# EAGLE design untitled (EAGLE 6.1)
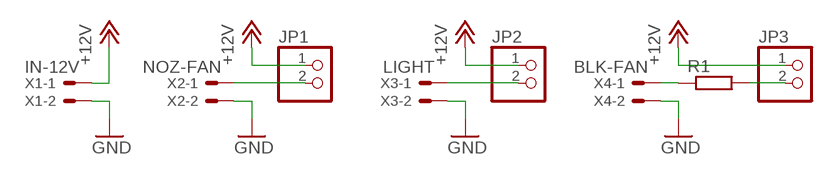
[diagram p0: schematic, sheet 1]

## Parts
JP1  PINHD-1X2  [1X02]
JP2  PINHD-1X2  [1X02]
JP3  PINHD-1X2  [1X02]
R1  R-EU_0204/7  [0204/7]
X1  IN-12V  JST-XH-02-PIN-LONG-PAD  [JST-XH-02-PACKAGE-LONG-PAD]
X2  NOZ-FAN  JST-XH-02-PIN-LONG-PAD  [JST-XH-02-PACKAGE-LONG-PAD]
X3  LIGHT  JST-XH-02-PIN-LONG-PAD  [JST-XH-02-PACKAGE-LONG-PAD]
X4  BLK-FAN  JST-XH-02-PIN-LONG-PAD  [JST-XH-02-PACKAGE-LONG-PAD]

## Nets
+12V: JP1.1 JP2.1 JP3.1 X1.1
GND: X1.2 X2.2 X3.2 X4.2
N$1: JP1.2 X2.1
N$2: JP2.2 X3.1
N$3: R1.1 X4.1
N$4: JP3.2 R1.2

## Library data of the parts
JP1-JP3 = pinhead:PINHD-1X2: PIN HEADER
R1 = rcl:R-EU_: RESISTOR, European symbol
X1-X4 = Rembrandt Electronics - JST XH Connectors v1-0:JST-XH-02-PIN: JST XH Connector 2 Pin Wire to board connector. Pitch: 2,54 mm, (0.100") Number of pins: 2 Created by Rembrandt Electronics www.rembrandtelectronics.com

## Board
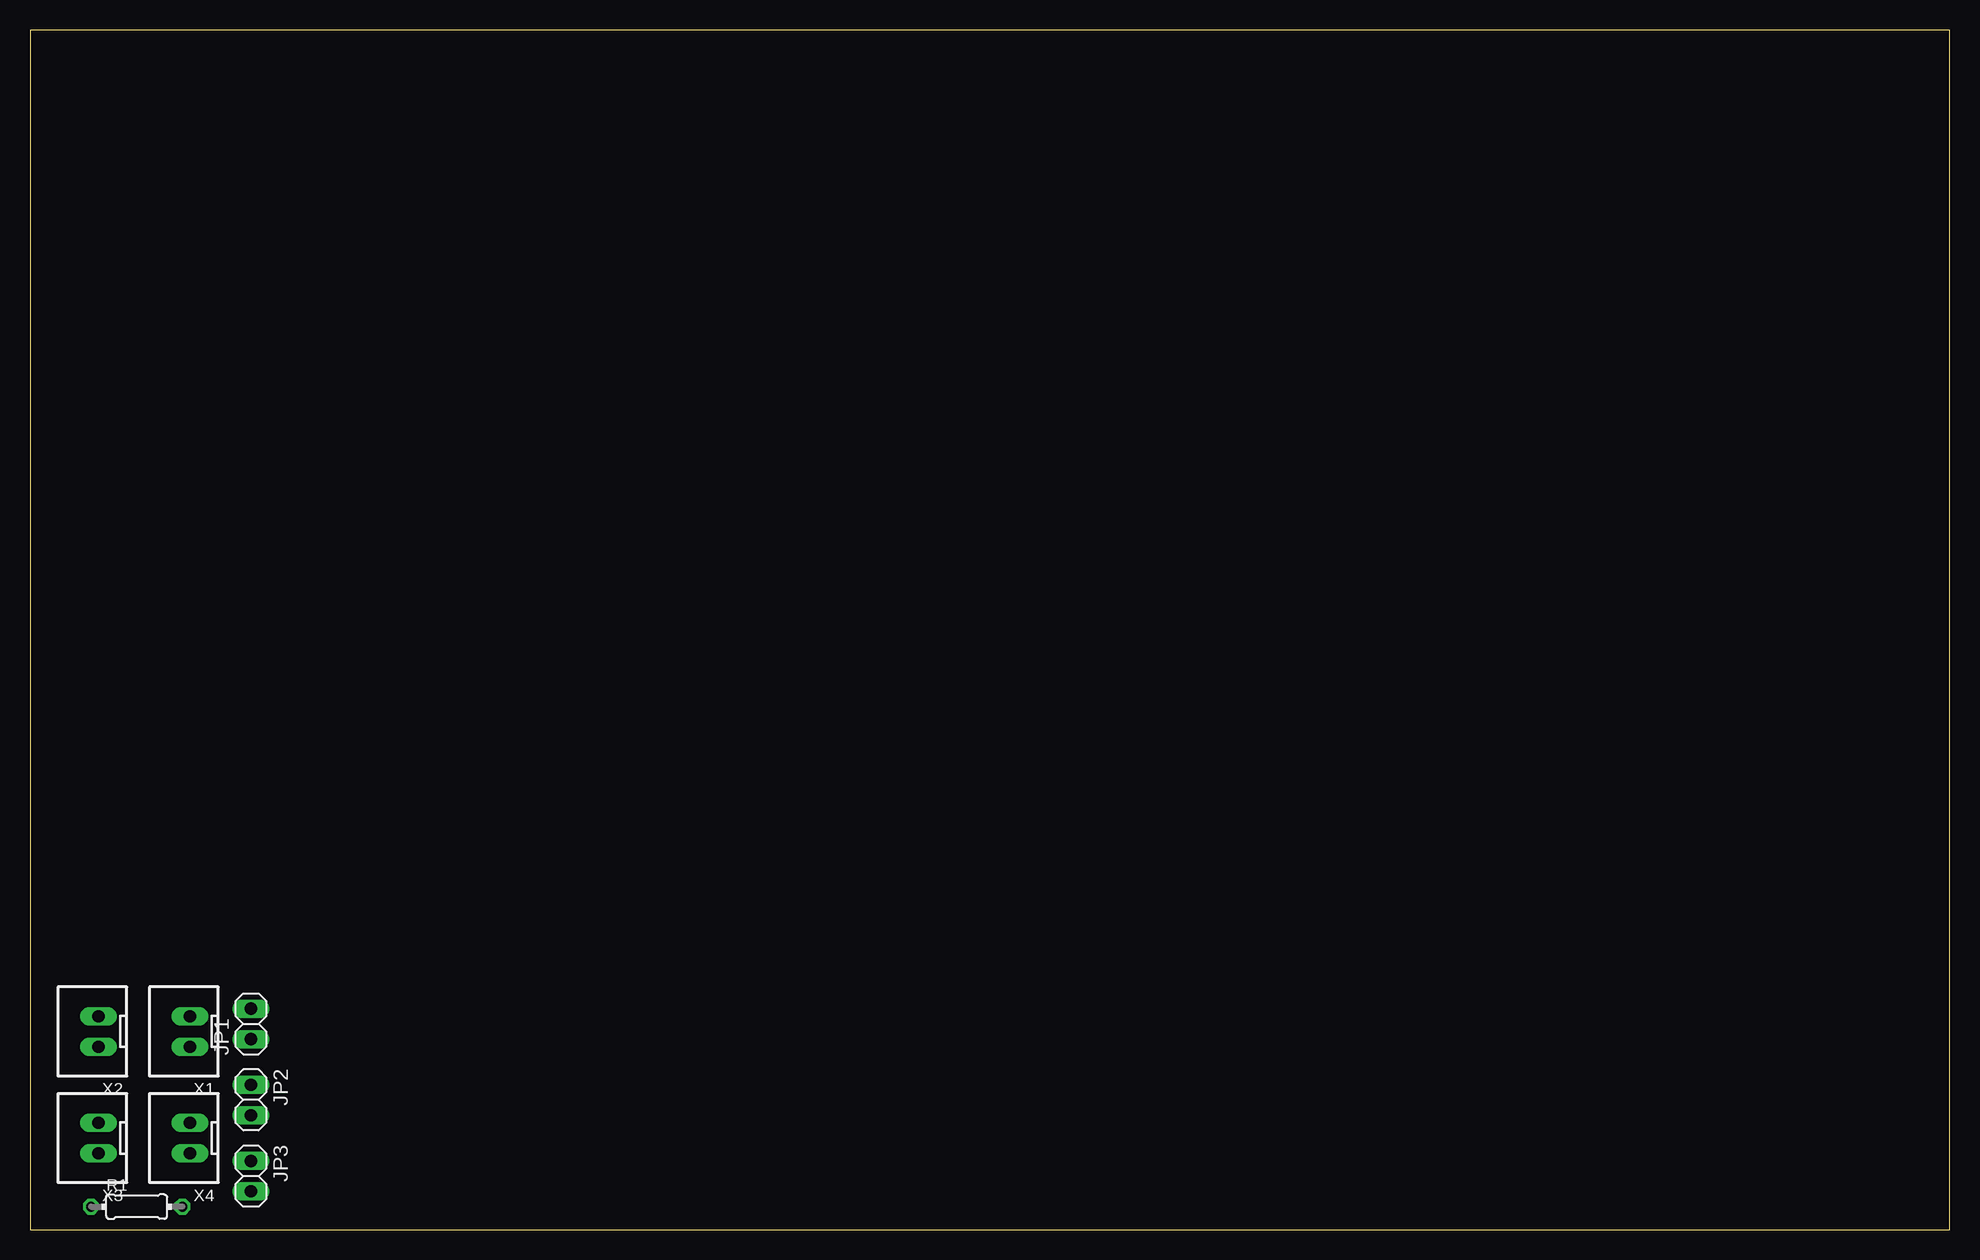
[diagram p1: board, top side]
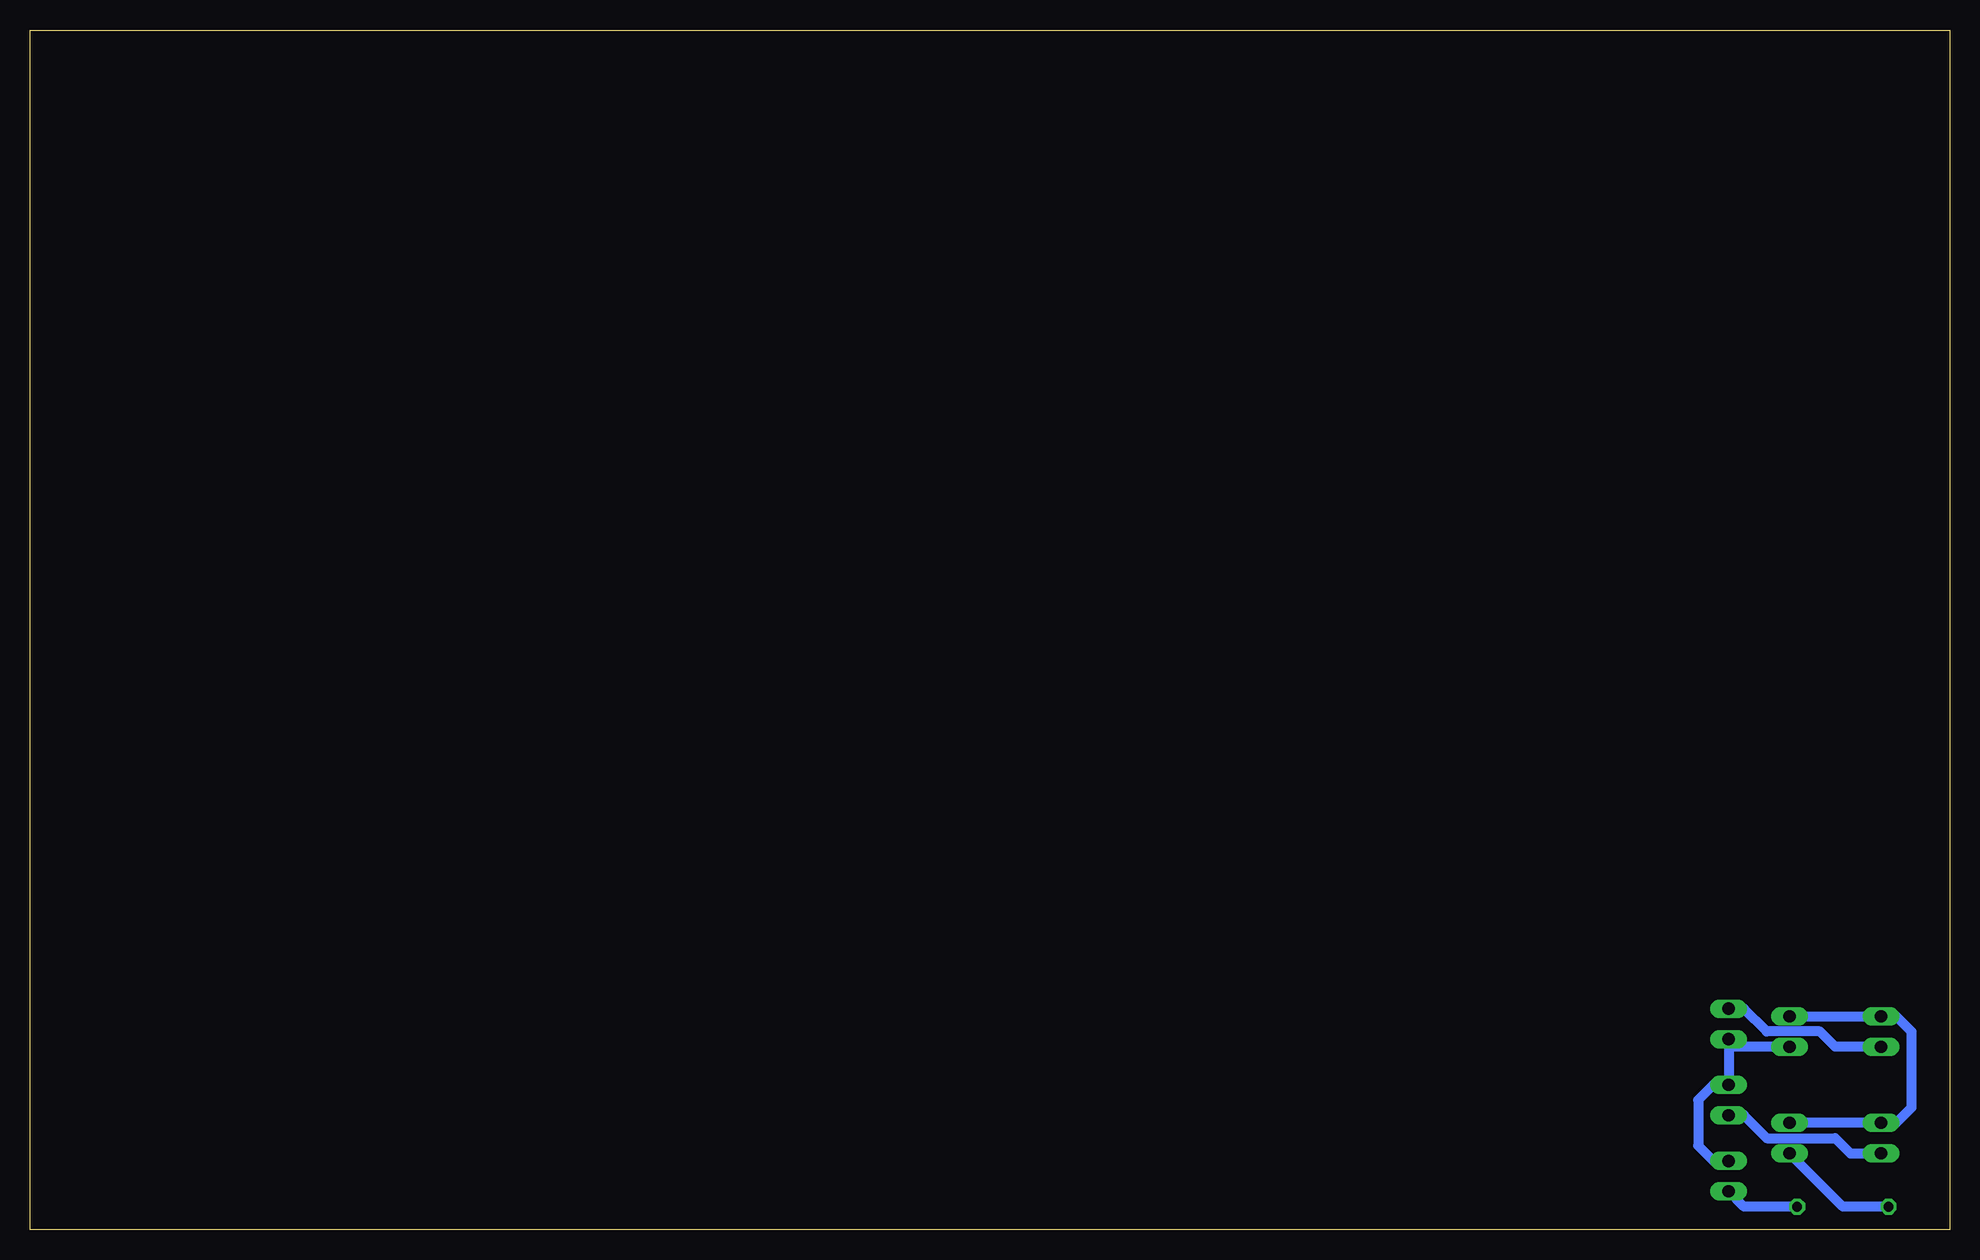
[diagram p2: board, bottom side, seen from below]

Size 160 x 100 mm. Coordinates in mm from the lower left corner, seen from the top.
Outline: 0,0 160,0 160,100 0,100 0,0
Copper layers (1*16): Top 0.035mm / dielectric 1.5mm / Bottom 0.035mm
Design rules: minimum track width 10mil, minimum drill 24mil, track to track 12mil, track to pad 12mil, pad to pad 12mil, via to via 12mil, smd to smd 10mil, copper to edge 12mil, drill to drill 12mil, minimum pad ring 10mil, minimum via ring 10mil, stop-mask expansion 4mil, vias tented up to drill 0mil, thermal gap 12mil

### Footprints (pad centres in the part's own frame; a part is rotated, then mirrored left to right if it is on the bottom)
1X02 = drill 1.016 long: 1 -1.27,0; 2 1.27,0
0204/7 = drill 0.813 octagon: 1 -3.81,0; 2 3.81,0
JST-XH-02-PACKAGE-LONG-PAD = drill 1.016 long: 1 -1.27,0; 2 1.27,0

### Placement (x,y rotation side)
JP1  18.41,17.14 90 top
JP2  18.41,10.79 270 top
JP3  18.41,4.45 270 top
R1  8.89,1.91 0 top
X1  13.34,16.51 90 top
X2  5.71,16.51 90 top
X3  5.71,7.62 90 top
X4  13.34,7.62 90 top

### Tracks (layer width: path | path; a pad name or v marks a point on that pad's centre or on a via)
+12V
  Bottom 0.813: JP1.1 18.41,15.24 | 18.41,15.24 JP2.1 19.68,12.06 20.95,10.79 20.95,6.99 19.68,5.71 JP3.1 | X1.1 18.41,15.24
GND
  Bottom 0.813: X1.2 X2.2 4.45,17.78 3.17,16.51 3.17,10.16 4.45,8.89 X3.2 X4.2
N$1
  Bottom 0.813: X2.1 9.53,15.24 10.79,16.51 15.24,16.51 17.14,18.41 JP1.2
N$2
  Bottom 0.813: JP2.2 17.14,9.53 15.24,7.62 9.53,7.62 8.26,6.35 X3.1
N$3
  Bottom 0.813: R1.1 8.89,1.91 X4.1
N$4
  Bottom 0.813: R1.2 17.14,1.91 JP3.2